# EAGLE design battery_V1.1 (EAGLE 9.4.2)
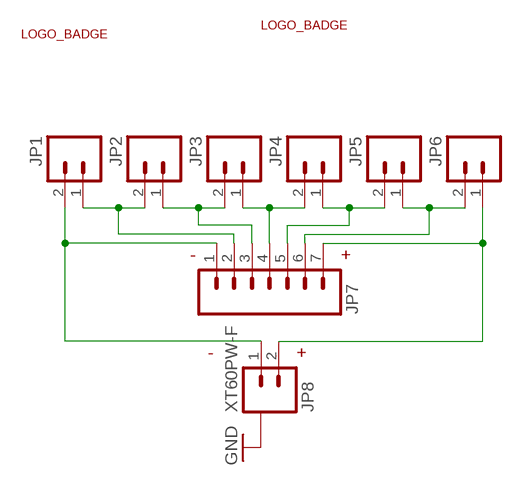
[diagram p0: schematic, sheet 1]

## Parts
JP1  M02_PH2.0_Z  [PH2.0_2Z]
JP2  M02_PH2.0_Z  [PH2.0_2Z]
JP3  M02_PH2.0_Z  [PH2.0_2Z]
JP4  M02_PH2.0_Z  [PH2.0_2Z]
JP5  M02_PH2.0_Z  [PH2.0_2Z]
JP6  M02_PH2.0_Z  [PH2.0_2Z]
JP7  M07_XH2.54_7Z  [XH2.54_7Z]
JP8  XT60PW-F  M02_G_XT60PW-F  [XT60PW-F]
U1  LOGO_BADGE_24.3_20_S  [LOGO_BADGE_24.3_20_S]
U2  LOGO_BADGE_12.2_9.5_S  [LOGO_BADGE_12.2_9.5_S]

## Nets
GND: JP8.P$1(G) JP8.P$2(G) JP8.P$3(G) JP8.P$4(G)
N$1: JP1.1 JP2.2 JP7.2
N$2: JP2.1 JP3.2 JP7.3
N$3: JP3.1 JP4.2 JP7.4
N$4: JP4.1 JP5.2 JP7.5
N$5: JP5.1 JP6.2 JP7.6
N$6: JP6.1 JP7.7 JP8.2
N$7: JP1.2 JP7.1 JP8.1

## Notes on the sheet
- - | +
- - | +

## Library data of the parts
JP1-JP6 = 2SparkFun:M02: Header 2 Standard 2-pin 0.1" header. Use with straight break away headers (SKU : PRT-00116), right angle break away headers (PRT-00553), swiss pins (PRT-00743), machine pins (PRT-00117), and female headers (PRT-00115). Molex polarized connector foot print use with SKU : PRT-08233 with associated crimp pins and housings.
JP7 = 2SparkFun:M07: Header 7 Standard 7-pin 0.1" header. Use with straight break away headers (SKU : PRT-00116), right angle break away headers (PRT-00553), swiss pins (PRT-00743), machine pins (PRT-00117), and female headers (PRT-00115). NOTES ON THE VARIANTS LOCK and LOCK_LONGPADS... This footprint was designed to help hold the alignment of a through-hole component (i.e. 7-pin header) while soldering it into place. You may notice that each hole has been shifted either up or down by 0.005 of an inch from it's more standard position (which is usually a perfectly straight line). This slight alteration caused the pins (the squares in the middle) to touch the edges of the holes. Because they are alternating, it causes a "brace" to hold the header in place. 0.005 has proven to be the perfect amount of "off-center" position when using our standard breakaway headers. Although looks a little odd when you look at the bare footprint, once you have a header in there, the alteration is very hard to notice. Also, if you push a header all the way into place, it is covered up entirely on the bottom side. This idea of altering the position of holes to aid alignment will be further integrated into the Sparkfun Library for other footprints. It can help hold any component with 3 or more connection pins.
JP8 = 2SparkFun:M02_G
U1 U2 = 2SparkFun:LOGO_BADGE

## Board
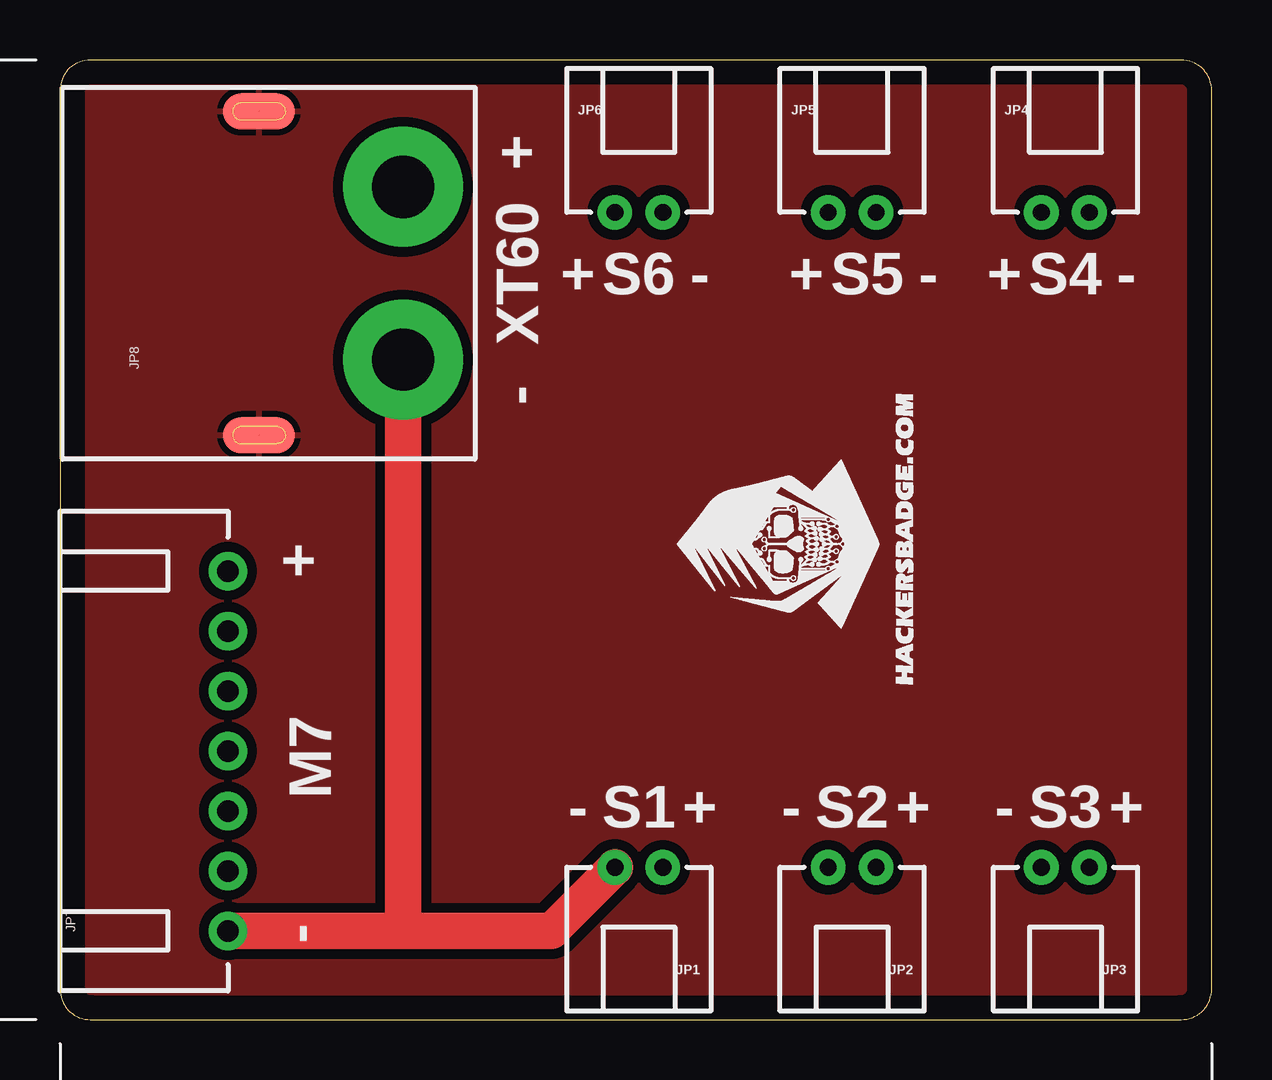
[diagram p1: board, top side]
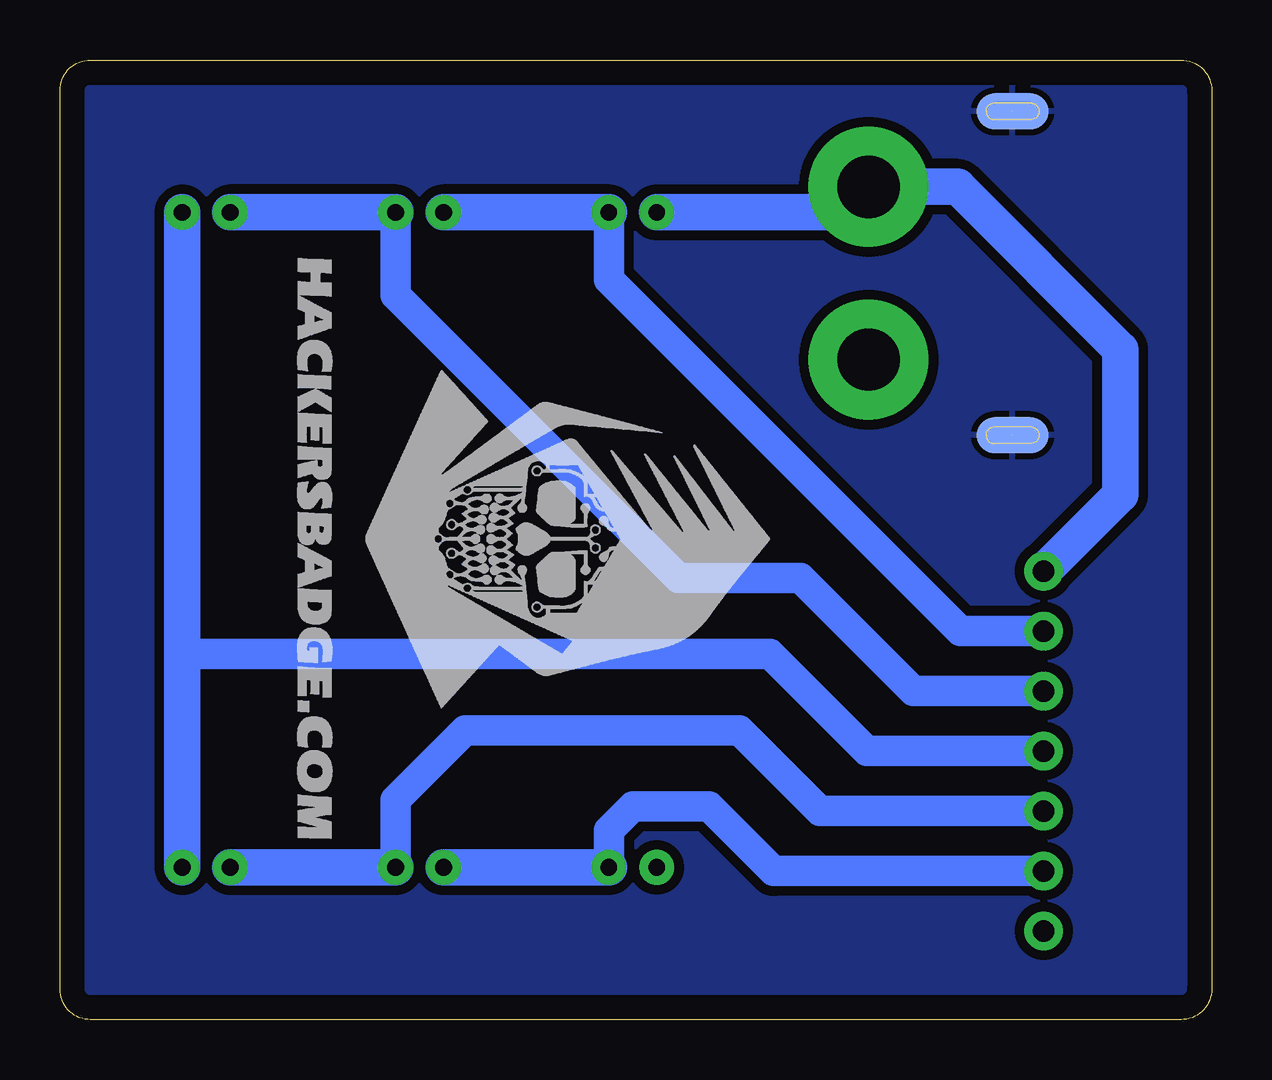
[diagram p2: board, bottom side, seen from below]

Size 48.01 x 40.01 mm. Coordinates in mm from the lower left corner, seen from the top.
Outline: 0,38.73 0,1.27 arc90 1.27,0 46.74,0 arc90 48.01,1.27 48.01,38.73 arc90 46.74,40.01 1.27,40.01 arc90 0,38.73
Copper layers (1*16): Top 0.035mm / dielectric 1.5mm / Bottom 0.035mm
Design rules "default": minimum track width 6mil, minimum drill 0.35mm, track to track 6mil, track to pad 6mil, pad to pad 6mil, via to via 6mil, smd to smd 6mil, copper to edge 40mil, drill to drill 6mil, minimum pad ring 10mil, minimum via ring 8mil, stop-mask expansion 4mil, vias tented up to drill 0mil, thermal gap 10mil

### Footprints (pad centres in the part's own frame; a part is rotated, then mirrored left to right if it is on the bottom)
PH2.0_2Z = drill 0.7 pad 1.448: 1 -1,0; 2 1,0
XH2.54_7Z = drill 0.9 pad 1.6: 1 -7.5,0; 2 -5,0; 3 -2.5,0; 4 0,0; 5 2.5,0; 6 5,0; 7 7.5,0
XT60PW-F = drill 2.6 pad 5: 1 -3.6,0; 2 3.6,0 | smd 1.5 x 3 bottom: P$1 6.75,6; P$3 -6.75,6 | smd 1.5 x 3: P$2 6.75,6; P$4 -6.75,6

### Placement (x,y rotation side)
JP1  24.13,6.35 180 top
JP2  33.02,6.35 180 top
JP3  41.91,6.35 180 top
JP4  41.91,33.66 0 top
JP5  33.02,33.66 0 top
JP6  24.13,33.66 0 top
JP7  7,11.2 90 top
JP8  14.3,31.11 90 top
U1  38.1,31.75 270 bottom
U2  35.56,13.97 90 top

### Tracks (layer width: path | path; a pad name or v marks a point on that pad's centre or on a via)
GND  (2 unrouted)
  pour Top (isolate 0.406): 0,40.01 48.26,40.01 48.26,0 0,0
  pour Bottom (isolate 0.406): 0,40.01 48.26,40.01 48.26,0 0,0
N$1
  Bottom 1.27: JP7.2 18.27,6.2 20.95,8.89 24.13,8.89 25.13,7.89 JP1.1
  Bottom 1.524: JP1.1 JP2.2
N$2
  Bottom 1.27: JP7.3 16.32,8.7 19.68,12.06 31.11,12.06 34.02,9.16 JP2.1
  Bottom 1.524: JP2.1 JP3.2
N$3
  Bottom 1.27: JP7.4 14.38,11.2 18.41,15.24 42.91,15.24
  Bottom 1.524: JP4.2 42.91,15.24 JP3.1
N$4
  Bottom 1.27: JP5.2 34.02,30.21 22.23,18.41 17.14,18.41 12.43,13.7 JP7.5
  Bottom 1.524: JP5.2 JP4.1
N$5
  Bottom 1.27: JP7.6 10.48,16.2 25.13,30.84 JP6.2
  Bottom 1.524: JP6.2 JP5.1
N$6
  Bottom 1.524: JP7.7 3.81,21.89 3.81,27.94 10.59,34.72 JP8.2 15.36,33.66 JP6.1
N$7
  Top 1.524: JP7.1 14.61,3.7 | JP8.1 14.3,4 14.61,3.7 | 14.61,3.7 20.48,3.7 JP1.2

### Text on the board
tPlace: + | XT60 | + | S6 | - | + | S5 | - | + | S4 | - | - | + | M7 | - | S1 | + | - | S2 | + | - | S3 | + | -